# Altium project 16SoundsUSB.PrjPCB (part 2 of 2)

## Sheet ADC.SchDoc
size Tabloid; DocumentNumber: 6; SheetNumber: 6; SheetTotal: 11; SheetName: ADC
Used 2 times, as channels ADC2, ADC1. Parts and nets are listed once, with the designators drawn on the sheet.
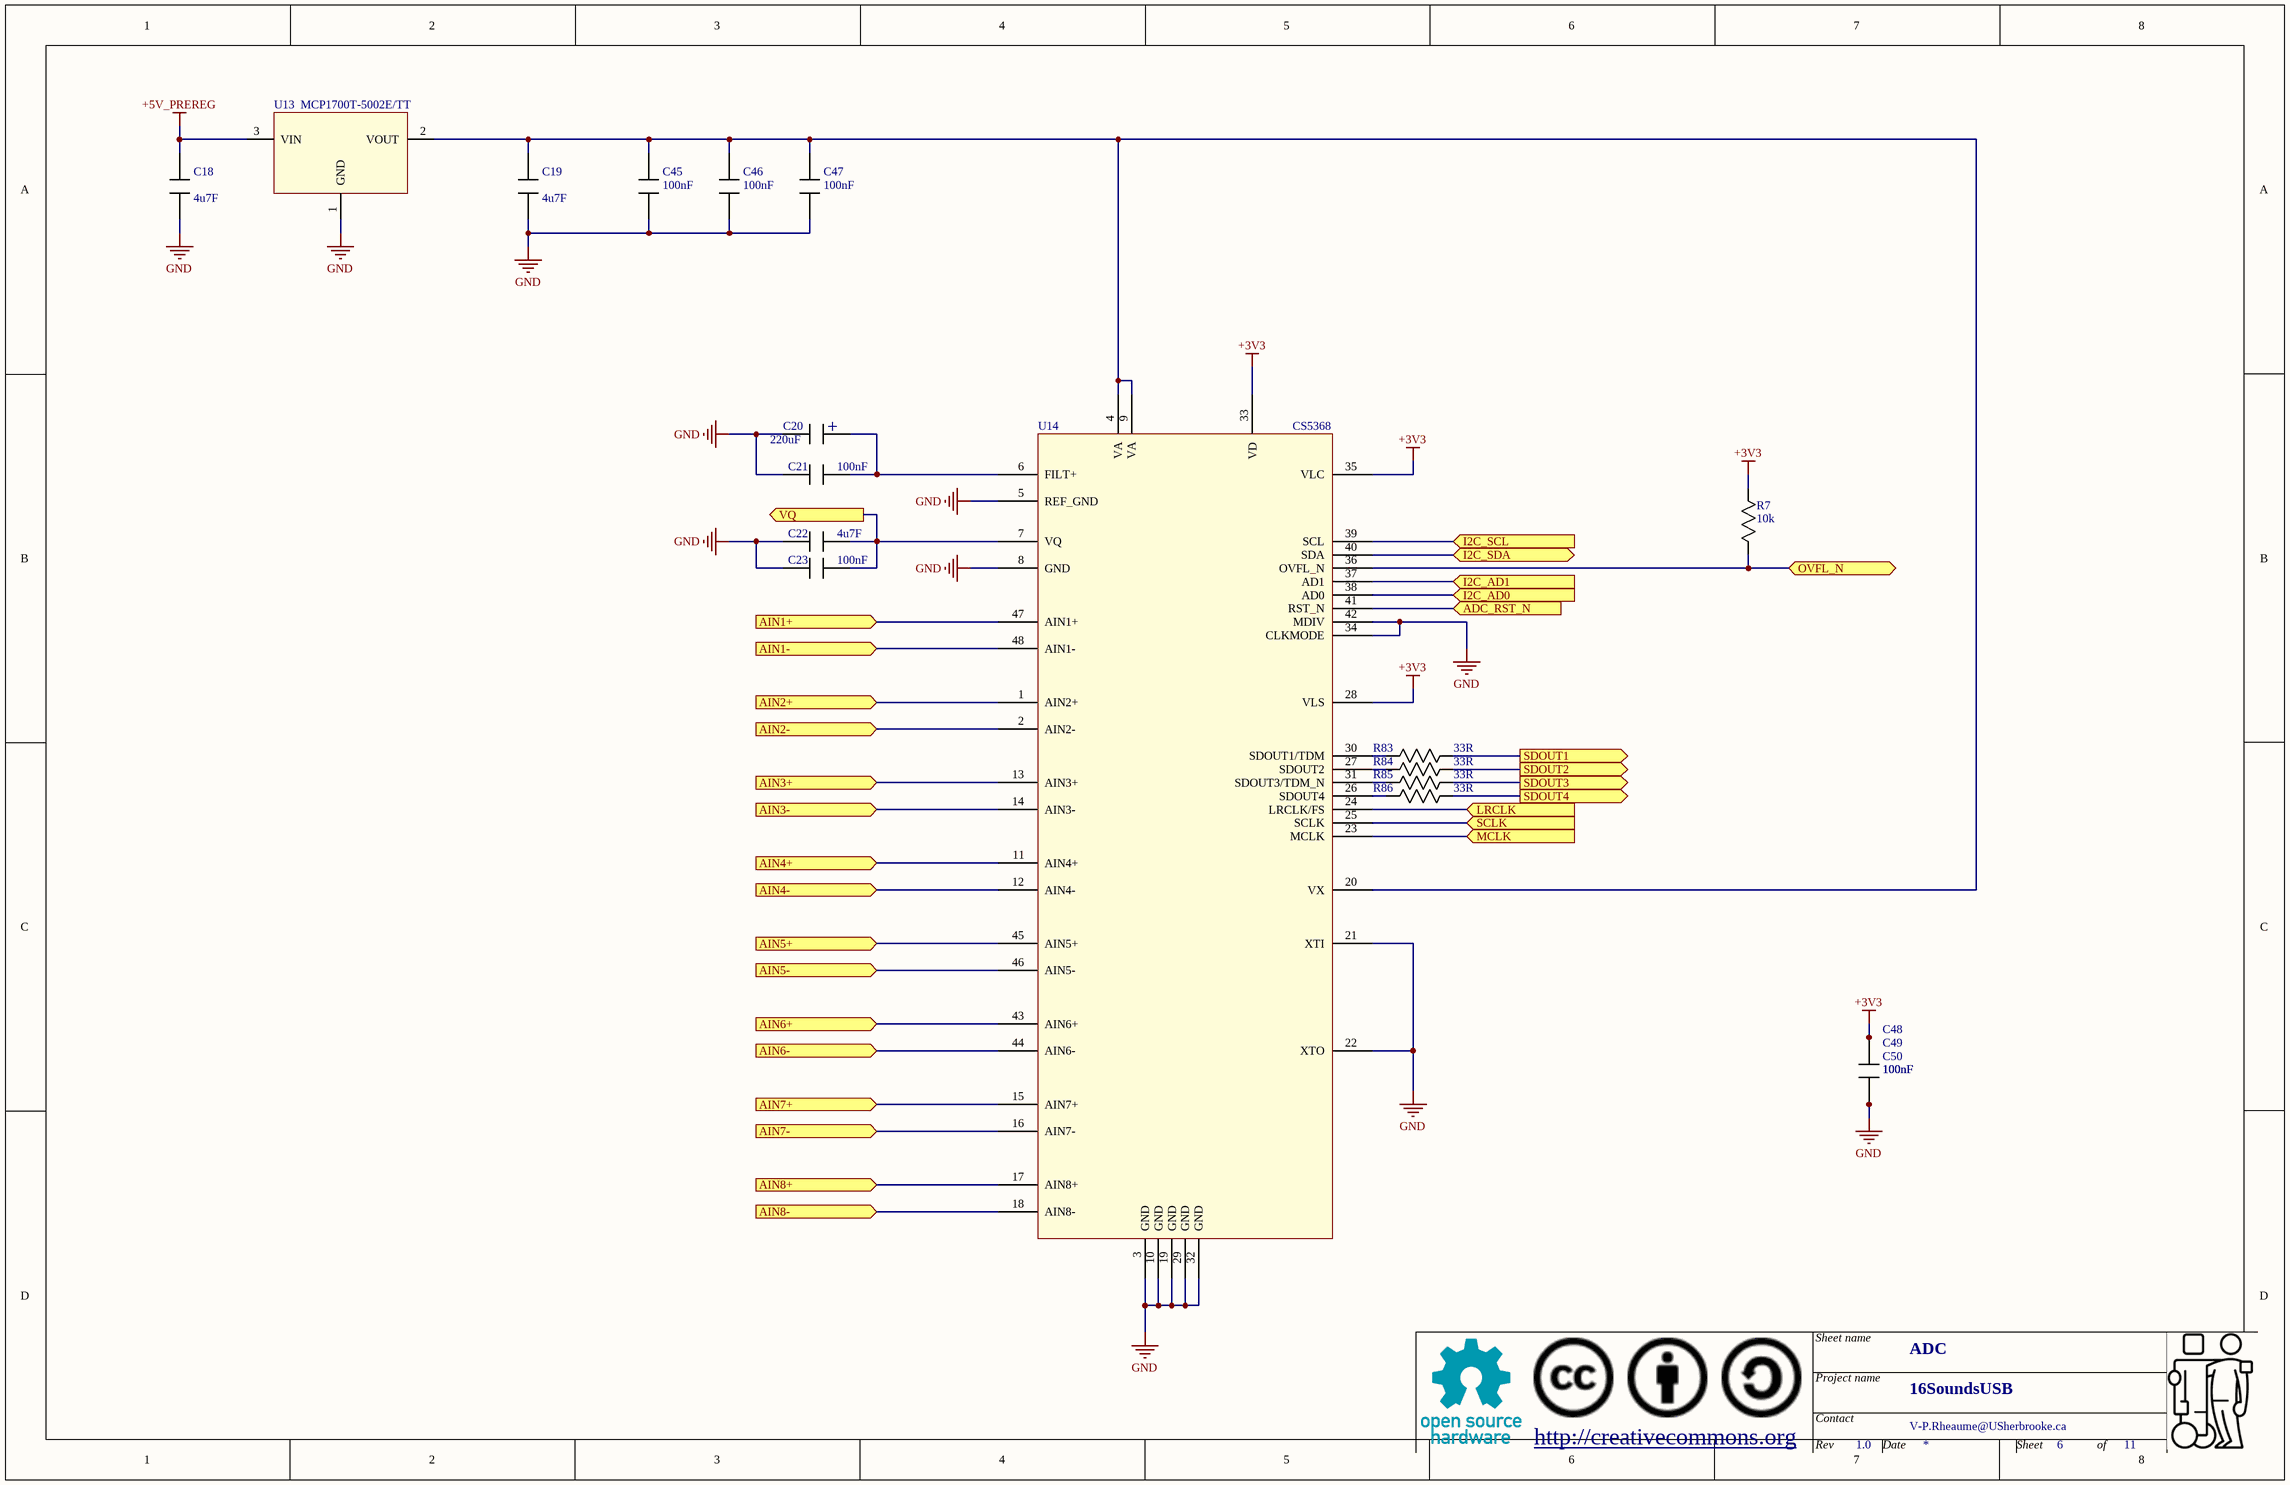
[diagram p7: ADC.SchDoc]

### Parts
C18  value 4u7F  [0805]  (hidden comment: Capacitor)
C19  value 4u7F  [0805]  (hidden comment: Capacitor)
C20  value 220uF  [CAP_RAD_SMD_DIA315]  (hidden comment: Capacitor_Polarized)
C21  value 100nF  [0603]  (hidden comment: Capacitor)
C22  value 4u7F  [0805]  (hidden comment: Capacitor)
C23  value 100nF  [0603]  (hidden comment: Capacitor)
C45  value 100nF  [0603]  (hidden comment: Capacitor)
C46  value 100nF  [0603]  (hidden comment: Capacitor)
C47  value 100nF  [0603]  (hidden comment: Capacitor)
C48  value 100nF  [0603]  (hidden comment: Capacitor)
C49  value 100nF  [0603]  (hidden comment: Capacitor)
C50  value 100nF  [0603]  (hidden comment: Capacitor)
R7  value 10k  [0603]  (hidden comment: Resistor)
R83  value 33R  [0603]  (hidden comment: Resistor)
R84  value 33R  [0603]  (hidden comment: Resistor)
R85  value 33R  [0603]  (hidden comment: Resistor)
R86  value 33R  [0603]  (hidden comment: Resistor)
U13  Mfg_PN: MCP1700T-5002E/TT  [SOT23_132]  (hidden comment: MCP1700)
U14  CS5368  [LQFP_48L_CIRRUS]

### Ports
ADC_RST_N (in), AIN1+ (in), AIN1- (in), AIN2+ (in), AIN2- (in), AIN3+ (in), AIN3- (in), AIN4+ (in), AIN4- (in), AIN5+ (in), AIN5- (in), AIN6+ (in), AIN6- (in), AIN7+ (in), AIN7- (in), AIN8+ (in), AIN8- (in), I2C_AD0 (in), I2C_AD1 (in), I2C_SCL (in), I2C_SDA (bidir), LRCLK (in), MCLK (in), OVFL_N (bidir), SCLK (in), SDOUT1 (out), SDOUT2 (out), SDOUT3 (out), SDOUT4 (out), VQ (out)

### Nets
+3V3: C48.1 C49.1 C50.1 R7.1 U14.28(VLS) U14.33(VD) U14.35(VLC)
+5V_PREREG: C18.1 U13.3(VIN)
GND: C18.2 C19.2 C20.- C21.2 C22.2 C23.2 C45.2 C46.2 C47.2 C48.2 C49.2 C50.2 U13.1(GND) U14.3(GND) U14.5(REF_GND) U14.8(GND) U14.10(GND) U14.19(GND) U14.21(XTI) U14.22(XTO) U14.29(GND) U14.32(GND) U14.34(CLKMODE) U14.42(MDIV)
ADC_RST_N: U14.41(RST_N) ; port ADC_RST_N
AIN1+: U14.47(AIN1+) ; port AIN1+
AIN1-: U14.48(AIN1-) ; port AIN1-
AIN2+: U14.1(AIN2+) ; port AIN2+
AIN2-: U14.2(AIN2-) ; port AIN2-
AIN3+: U14.13(AIN3+) ; port AIN3+
AIN3-: U14.14(AIN3-) ; port AIN3-
AIN4+: U14.11(AIN4+) ; port AIN4+
AIN4-: U14.12(AIN4-) ; port AIN4-
AIN5+: U14.45(AIN5+) ; port AIN5+
AIN5-: U14.46(AIN5-) ; port AIN5-
AIN6+: U14.43(AIN6+) ; port AIN6+
AIN6-: U14.44(AIN6-) ; port AIN6-
AIN7+: U14.15(AIN7+) ; port AIN7+
AIN7-: U14.16(AIN7-) ; port AIN7-
AIN8+: U14.17(AIN8+) ; port AIN8+
AIN8-: U14.18(AIN8-) ; port AIN8-
I2C_AD0: U14.38(AD0) ; port I2C_AD0
I2C_AD1: U14.37(AD1) ; port I2C_AD1
I2C_SCL: U14.39(SCL) ; port I2C_SCL
I2C_SDA: U14.40(SDA) ; port I2C_SDA
LRCLK: U14.24(LRCLK/FS) ; port LRCLK
MCLK: U14.23(MCLK) ; port MCLK
OVFL_N: R7.2 U14.36(OVFL_N) ; port OVFL_N
SCLK: U14.25(SCLK) ; port SCLK
SDOUT1: R83.2 ; port SDOUT1
SDOUT2: R84.2 ; port SDOUT2
SDOUT3: R85.2 ; port SDOUT3
SDOUT4: R86.2 ; port SDOUT4
VQ: C22.1 C23.1 U14.7(VQ) ; port VQ
NetC19_1: C19.1 C45.1 C46.1 C47.1 U13.2(VOUT) U14.4(VA) U14.9(VA) U14.20(VX)
NetC20_+: C20.+ C21.1 U14.6(FILT+)
NetR83_1: R83.1 U14.30(SDOUT1/TDM)
NetR84_1: R84.1 U14.27(SDOUT2)
NetR85_1: R85.1 U14.31(SDOUT3/TDM_N)
NetR86_1: R86.1 U14.26(SDOUT4)

### Channels
ADC2: designators end in _ADC2; ports ADC_RST_N=NetTP3_1 AIN1+=IN13_P AIN1-=IN13_N AIN2+=IN14_P AIN2-=IN14_N AIN3+=IN11_P AIN3-=IN11_N AIN4+=IN12_P AIN4-=IN12_N AIN5+=IN15_P AIN5-=IN15_N AIN6+=IN16_P AIN6-=IN16_N AIN7+=IN9_P AIN7-=IN9_N AIN8+=IN10_P AIN8-=IN10_N I2C_AD0=GND I2C_AD1=GND I2C_SCL=I2C_SCL I2C_SDA=I2C_SDA LRCLK=LRCLK MCLK=MCLK_AUDIO OVFL_N=NetR7_ADC1_2 SCLK=SCLK SDOUT1=ADC2_SDOUT1 SDOUT2=ADC2_SDOUT2 SDOUT3=ADC2_SDOUT3 SDOUT4=ADC2_SDOUT4 VQ=ADC2_VQ
ADC1: designators end in _ADC1; ports ADC_RST_N=NetTP3_1 AIN1+=IN5_P AIN1-=IN5_N AIN2+=IN6_P AIN2-=IN6_N AIN3+=IN3_P AIN3-=IN3_N AIN4+=IN4_P AIN4-=IN4_N AIN5+=IN7_P AIN5-=IN7_N AIN6+=IN8_P AIN6-=IN8_N AIN7+=IN1_P AIN7-=IN1_N AIN8+=IN2_P AIN8-=IN2_N I2C_AD0=+3V3 I2C_AD1=GND I2C_SCL=I2C_SCL I2C_SDA=I2C_SDA LRCLK=LRCLK MCLK=MCLK_AUDIO OVFL_N=NetR7_ADC1_2 SCLK=SCLK SDOUT1=ADC1_SDOUT1 SDOUT2=ADC1_SDOUT2 SDOUT3=ADC1_SDOUT3 SDOUT4=ADC1_SDOUT4 VQ=ADC1_VQ

### Notes on the sheet
- Sheet name
- http://creativecommons.org
- Project name
- Contact
- Rev
- Date
- Sheet
- of

### Library data of the parts
C18 C19 C22 = Capacitor: Mfg: Samsung; Mfg_PN: CL21A475KAQNNNG; HelpURL: *; NI: *; Supplier1: Digikey; Supplier1_PN: 1276-6462-1-ND; Tolerance: *; Type: *; Rating: *
C20 = Capacitor_Polarized: Capacitor; Mfg: Nichicon; Mfg_PN: UWT1E221MNL1GS; HelpURL: *; NI: *; Supplier1: Digikey; Supplier1_PN: 493-2192-1-ND; Tolerance: *; Type: *; Rating: *
C21 C23 C45-C50 = Capacitor: Mfg: Samsung; Mfg_PN: CL10F104ZO8NNNC; HelpURL: *; NI: *; Supplier1: Digikey; Supplier1_PN: 1276-1258-1-ND; Tolerance: *; Type: *; Rating: *
R7 = Resistor: Mfg: Yageo; Mfg_PN: RC0603JR-0710KL; HelpURL: *; NI: *; Supplier1: Digikey; Supplier1_PN: 311-10KGRCT-ND; Type: *; Rating: *; Tolerance: *
R83-R86 = Resistor: Mfg: Yageo; Mfg_PN: RC0603JR-0733RL; HelpURL: *; NI: *; Supplier1: Digikey; Supplier1_PN: 311-33GRCT-ND; Type: *; Rating: *; Tolerance: *
U13 = MCP1700: Linear voltage regulator; Mfg: Microchip; HelpURL: http://ww1.microchip.com/downloads/en/DeviceDoc/20001826C.pdf; NI: *; Supplier1: Digikey; Supplier1_PN: MCP1700T5002ETTCT-ND; Type: *
U14 = CS5368: ADC, 24bit, 8 chan, 192kHz, PCM, TDM, LQFP48; Mfg_PN: CS5368-CQZ; Mfg: Cirrus; Supplier1: Digikey; Supplier1_PN: 598-1090-ND

## Sheet DAC.SchDoc
size Tabloid; DocumentNumber: 7; SheetNumber: 7; SheetTotal: 11; SheetName: DAC
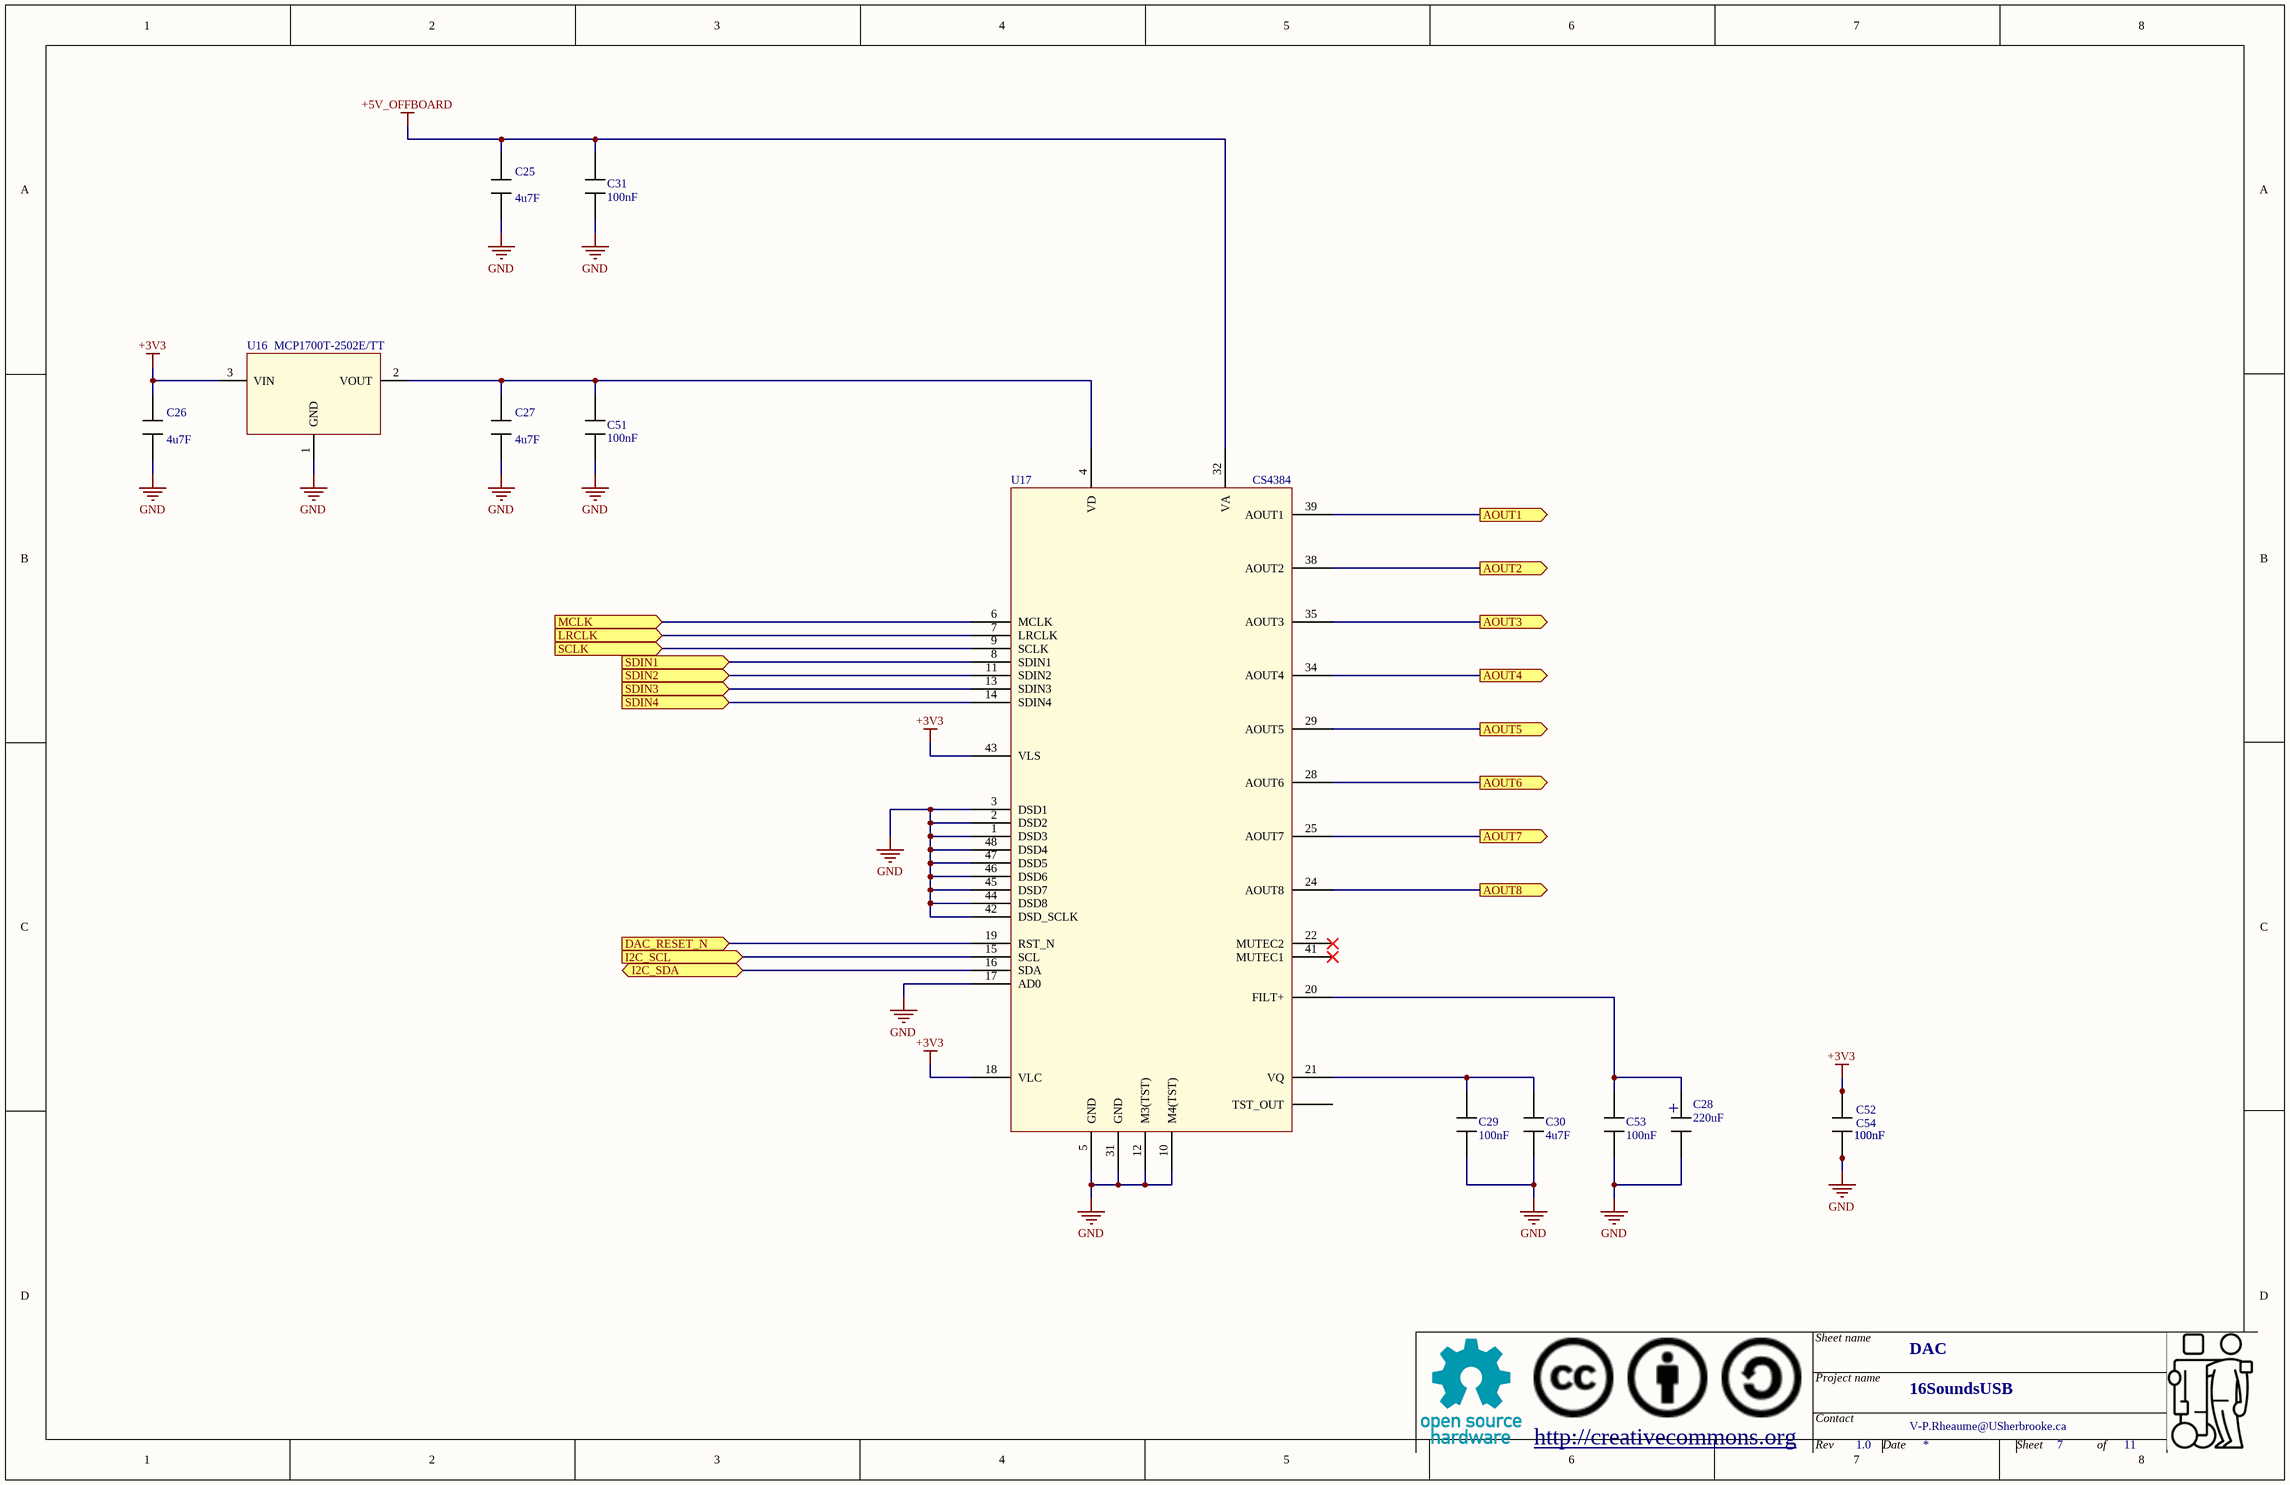
[diagram p8: DAC.SchDoc]

### Parts
C25  value 4u7F  [0805]  (hidden comment: Capacitor)
C26  value 4u7F  [0805]  (hidden comment: Capacitor)
C27  value 4u7F  [0805]  (hidden comment: Capacitor)
C28  value 220uF  [CAP_RAD_SMD_DIA315]  (hidden comment: Capacitor_Polarized)
C29  value 100nF  [0603]  (hidden comment: Capacitor)
C30  value 4u7F  [0805]  (hidden comment: Capacitor)
C31  value 100nF  [0603]  (hidden comment: Capacitor)
C51  value 100nF  [0603]  (hidden comment: Capacitor)
C52  value 100nF  [0603]  (hidden comment: Capacitor)
C53  value 100nF  [0603]  (hidden comment: Capacitor)
C54  value 100nF  [0603]  (hidden comment: Capacitor)
U16  Mfg_PN: MCP1700T-2502E/TT  [SOT23_132]  (hidden comment: MCP1700)
U17  CS4384  [LQFP_48L_CIRRUS]

### Ports
AOUT1 (out), AOUT2 (out), AOUT3 (out), AOUT4 (out), AOUT5 (out), AOUT6 (out), AOUT7 (out), AOUT8 (out), DAC_RESET_N (in), I2C_SCL (in), I2C_SDA (bidir), LRCLK (in), MCLK (in), SCLK (in), SDIN1 (in), SDIN2 (in), SDIN3 (in), SDIN4 (in)

### Nets
+3V3: C26.1 C52.1 C54.1 U16.3(VIN) U17.18(VLC) U17.43(VLS)
+5V_OFFBOARD: C25.1 C31.1 U17.32(VA)
GND: C25.2 C26.2 C27.2 C28.- C29.2 C30.2 C31.2 C51.2 C52.2 C53.2 C54.2 U16.1(GND) U17.1(DSD3) U17.2(DSD2) U17.3(DSD1) U17.5(GND) U17.10(M4(TST)) U17.12(M3(TST)) U17.17(AD0) U17.31(GND) U17.42(DSD_SCLK) U17.44(DSD8) U17.45(DSD7) U17.46(DSD6) U17.47(DSD5) U17.48(DSD4)
DAC_SDIN1: U17.8(SDIN1) ; port SDIN1
DAC_SDIN2: U17.11(SDIN2) ; port SDIN2
I2C_SCL: U17.15(SCL) ; port I2C_SCL
I2C_SDA: U17.16(SDA) ; port I2C_SDA
LRCLK: U17.7(LRCLK) ; port LRCLK
MCLK_AUDIO: U17.6(MCLK) ; port MCLK
SCLK: U17.9(SCLK) ; port SCLK
NetC27_1: C27.1 C51.1 U16.2(VOUT) U17.4(VD)
NetC28_+: C28.+ C53.1 U17.20(FILT+)
NetC29_1: C29.1 C30.1 U17.21(VQ)
NetC36_+: U17.39(AOUT1) ; port AOUT1
NetC37_+: U17.35(AOUT3) ; port AOUT3
NetC40_+: U17.38(AOUT2) ; port AOUT2
NetC41_+: U17.34(AOUT4) ; port AOUT4
NetU4_94: U17.19(RST_N) ; port DAC_RESET_N
NetU17_13: U17.13(SDIN3) ; port SDIN3
NetU17_14: U17.14(SDIN4) ; port SDIN4
NetU17_24: U17.24(AOUT8) ; port AOUT8
NetU17_25: U17.25(AOUT7) ; port AOUT7
NetU17_28: U17.28(AOUT6) ; port AOUT6
NetU17_29: U17.29(AOUT5) ; port AOUT5

Not connected (* = marked no-connect by the designer): U17 22(MUTEC2)* 23(TST_OUT) 26(TST_OUT) 27(TST_OUT) 30(TST_OUT) 33(TST_OUT) 36(TST_OUT) 37(TST_OUT) 40(TST_OUT) 41(MUTEC1)*

### Notes on the sheet
- Sheet name
- http://creativecommons.org
- Project name
- Contact
- Rev
- Date
- Sheet
- of

### Library data of the parts
C25-C27 C30 = Capacitor: Mfg: Samsung; Mfg_PN: CL21A475KAQNNNG; HelpURL: *; NI: *; Supplier1: Digikey; Supplier1_PN: 1276-6462-1-ND; Tolerance: *; Type: *; Rating: *
C28 = Capacitor_Polarized: as C20 on sheet ADC; HelpURL: *; NI: *; Supplier1: Digikey; Supplier1_PN: 493-2192-1-ND; Tolerance: *; Type: *; Rating: *
C29 C31 C51-C54 = Capacitor: Mfg: Samsung; Mfg_PN: CL10F104ZO8NNNC; HelpURL: *; NI: *; Supplier1: Digikey; Supplier1_PN: 1276-1258-1-ND; Tolerance: *; Type: *; Rating: *
U16 = MCP1700: Linear voltage regulator; Mfg: Microchip; HelpURL: http://ww1.microchip.com/downloads/en/DeviceDoc/20001826C.pdf; NI: *; Supplier1: Digikey; Supplier1_PN: MCP1700T-2502E/TTCT-ND; Type: *
U17 = CS4384: DAC, 24-bit, 8 chan, 192kHz, PCM, TDM, DSD, LQFP48; Mfg: Cirrus; Mfg_PN: CS4384-CQZ; Supplier1: Digikey; Supplier1_PN: 598-1062-ND

## Sheet OutputConnectors.SchDoc
size Tabloid; DocumentNumber: 8; SheetNumber: 8; SheetTotal: 11; SheetName: Audio output connectors
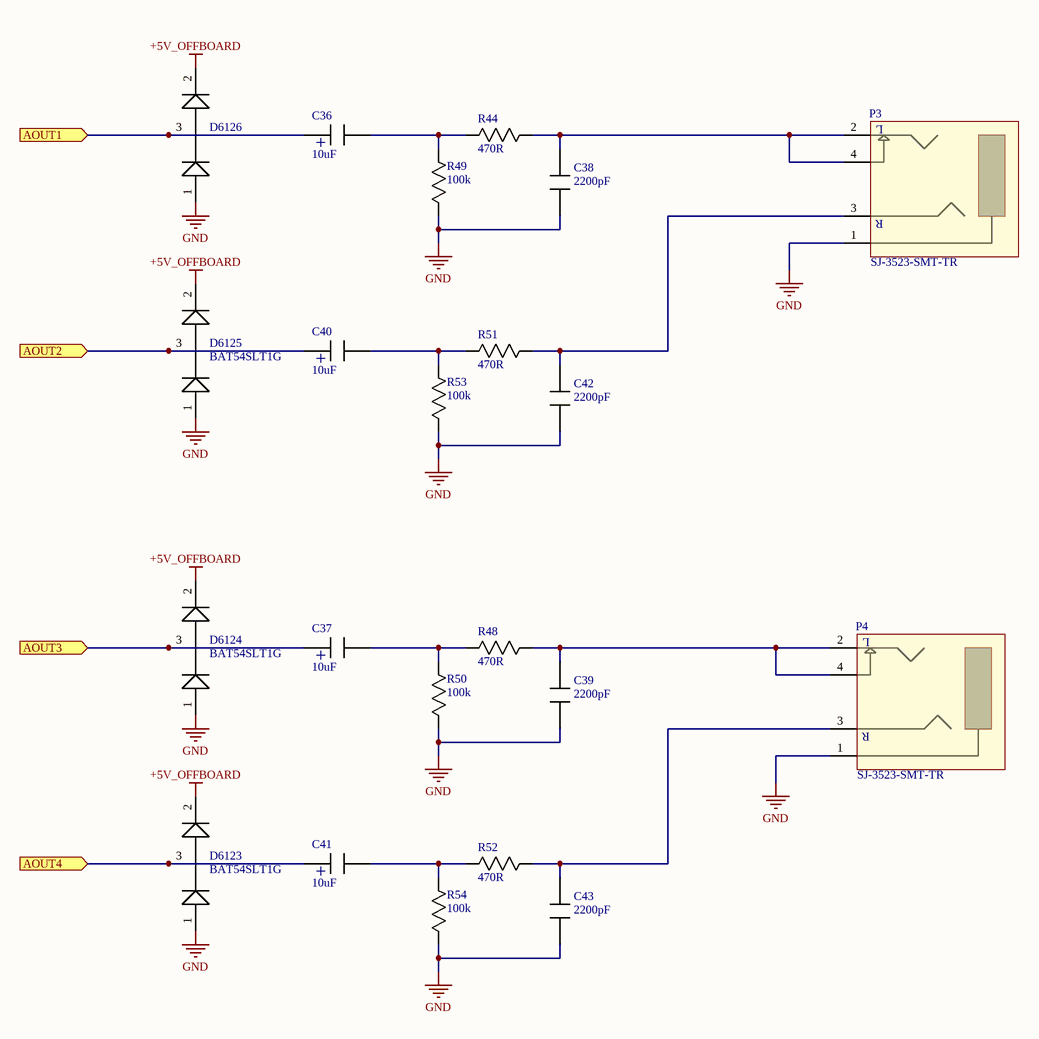
[diagram p9: OutputConnectors.SchDoc]

### Parts
C36  value 10uF  [CAP_RAD_SMD_DIA157]  (hidden comment: Capacitor_Polarized)
C37  value 10uF  [CAP_RAD_SMD_DIA157]  (hidden comment: Capacitor_Polarized)
C38  value 2200pF  [0603]  (hidden comment: Capacitor)
C39  value 2200pF  [0603]  (hidden comment: Capacitor)
C40  value 10uF  [CAP_RAD_SMD_DIA157]  (hidden comment: Capacitor_Polarized)
C41  value 10uF  [CAP_RAD_SMD_DIA157]  (hidden comment: Capacitor_Polarized)
C42  value 2200pF  [0603]  (hidden comment: Capacitor)
C43  value 2200pF  [0603]  (hidden comment: Capacitor)
D6123  Mfg_PN: BAT54SLT1G  [SOT23_132]  (hidden comment: Diode_dual)
D6124  Mfg_PN: BAT54SLT1G  [SOT23_132]  (hidden comment: Diode_dual)
D6125  Mfg_PN: BAT54SLT1G  [SOT23_132]  (hidden comment: Diode_dual)
D6126  Diode_dual  [SOT23_132]  (value not drawn)
P3  Mfg_PN: SJ-3523-SMT-TR  [CONN_3.5mm_CUI 3523-SMT]  (hidden comment: CON_AUDIO_3.5mm_TRS_ALT1)
P4  Mfg_PN: SJ-3523-SMT-TR  [CONN_3.5mm_CUI 3523-SMT]  (hidden comment: CON_AUDIO_3.5mm_TRS_ALT1)
R44  value 470R  [0603]  (hidden comment: Resistor)
R48  value 470R  [0603]  (hidden comment: Resistor)
R49  value 100k  [0603]  (hidden comment: Resistor)
R50  value 100k  [0603]  (hidden comment: Resistor)
R51  value 470R  [0603]  (hidden comment: Resistor)
R52  value 470R  [0603]  (hidden comment: Resistor)
R53  value 100k  [0603]  (hidden comment: Resistor)
R54  value 100k  [0603]  (hidden comment: Resistor)

### Ports
AOUT1 (in), AOUT2 (in), AOUT3 (in), AOUT4 (in)

### Nets
+5V_OFFBOARD: D6123.2(K) D6124.2(K) D6125.2(K) D6126.2(K)
GND: C38.2 C39.2 C42.2 C43.2 D6123.1(K) D6124.1(K) D6125.1(K) D6126.1(K) P3.1 P4.1 R49.1 R50.1 R53.1 R54.1
NetC36_+: C36.+ D6126.3(AK) ; port AOUT1
NetC36_-: C36.- R44.1 R49.2
NetC37_+: C37.+ D6124.3(AK) ; port AOUT3
NetC37_-: C37.- R48.1 R50.2
NetC38_1: C38.1 P3.2(L) P3.4(NC_L) R44.2
NetC39_1: C39.1 P4.2(L) P4.4(NC_L) R48.2
NetC40_+: C40.+ D6125.3(AK) ; port AOUT2
NetC40_-: C40.- R51.1 R53.2
NetC41_+: C41.+ D6123.3(AK) ; port AOUT4
NetC41_-: C41.- R52.1 R54.2
NetC42_1: C42.1 P3.3(R) R51.2
NetC43_1: C43.1 P4.3(R) R52.2

### Notes on the sheet
- Sheet name
- http://creativecommons.org
- Project name
- Contact
- Rev
- Date
- Sheet
- of

### Library data of the parts
C36 C37 C40 C41 = Capacitor_Polarized: Capacitor; Mfg: Nichicon; Mfg_PN: UWX1C100MCL1GB; HelpURL: *; NI: *; Supplier1: Digikey; Supplier1_PN: 493-2100-1-ND; Tolerance: *; Type: *; Rating: *
C38 C39 C42 C43 = Capacitor: Mfg: Murata; Mfg_PN: GRM1885C1H222JA01D; HelpURL: *; NI: *; Supplier1: Digikey; Supplier1_PN: 490-1459-1-ND; Tolerance: *; Type: *; Rating: *
D6123-D6125 = Diode_dual: Diode; Mfg: Onsemi; HelpURL: *; NI: *; Supplier1: Digikey; Supplier1_PN: BAT54SLT1GOSCT-ND; Tolerance: *; Type: *; Rating: *; Value: *
D6126 = Diode_dual: Diode; Mfg: Onsemi; Mfg_PN: BAT54SLT1G; HelpURL: *; NI: *; Supplier1: Digikey; Supplier1_PN: BAT54SLT1GOSCT-ND; Tolerance: *; Type: *; Rating: *; Value: *
P3 P4 = CON_AUDIO_3.5mm_TRS_ALT1: Audio 3.5mm CUI SJ-3523-SMT-TR; HelpURL: *; Mfg: CUI; NI: *; Rating: *; Supplier1: Digikey; Supplier1_PN: CP-3523SJCT-ND; Tolerance: *; Type: *; Value: *
R44 R48 R51 R52 = Resistor: Mfg: Yageo; Mfg_PN: RC0603JR-07470RL; HelpURL: *; NI: *; Supplier1: Digikey; Supplier1_PN: 311-470GRCT-ND; Type: *; Rating: *; Tolerance: *
R49 R50 R53 R54 = Resistor: Mfg: Yageo; Mfg_PN: 311-10GRCT-ND; HelpURL: *; NI: *; Supplier1: Digikey; Supplier1_PN: 311-100KGRCT-ND; Type: *; Rating: *; Tolerance: *

## Sheet Other.SchDoc
size Tabloid; DocumentNumber: 9; SheetNumber: 9; SheetTotal: 11; SheetName: LEDs and I2C exp. connector
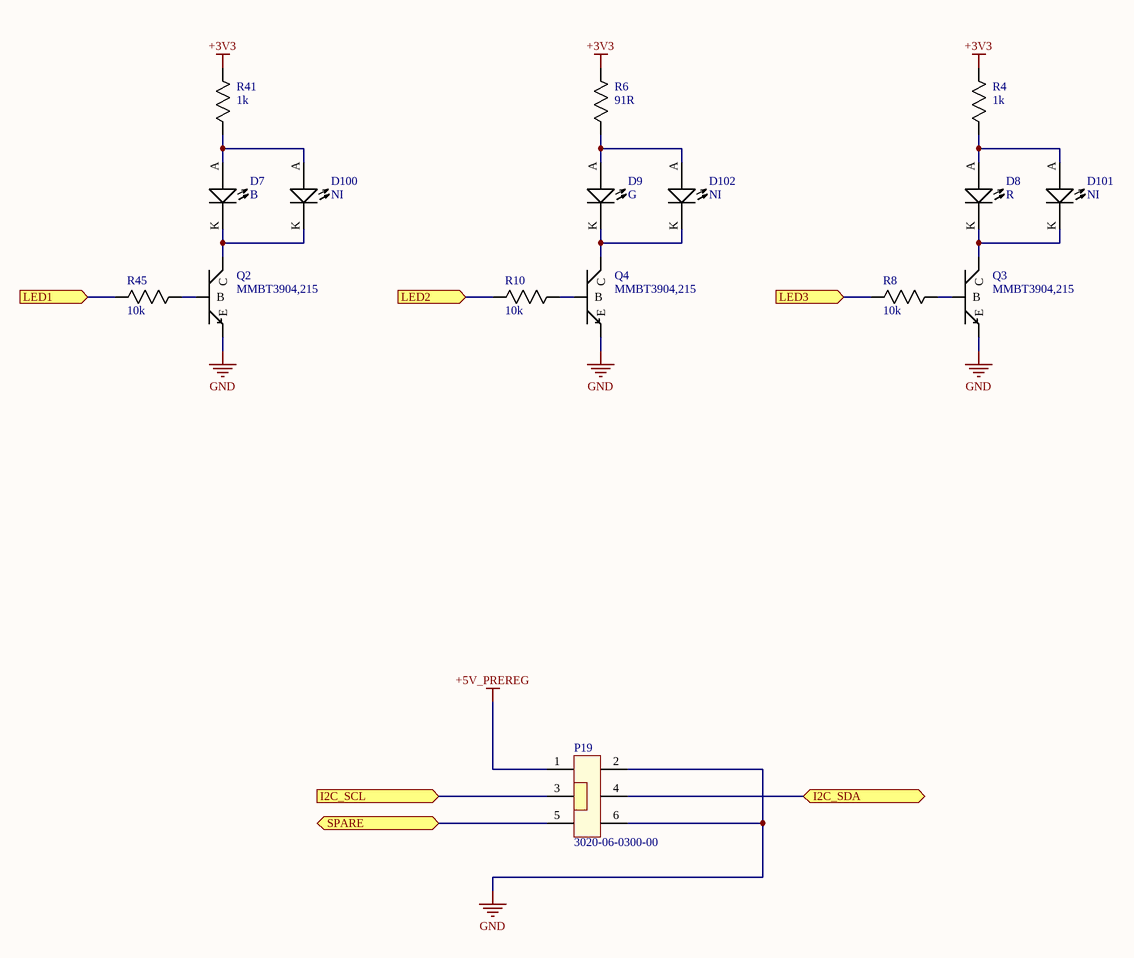
[diagram p10: Other.SchDoc]

### Parts
(Parts that share a designator on the sheet are numbered #1, #2 ... from top to bottom, then left to right.)
D7  Type: B  [0805_LED]  (hidden comment: Diode_LED)
D8  Type: R  [0805_LED]  (hidden comment: Diode_LED)
D9  Type: G  [0805_LED]  (hidden comment: Diode_LED)
D100  Diode_LED  [0805_LED]  (value not drawn)
D101  Diode_LED  [0805_LED]  (value not drawn)
D102  Diode_LED  [0805_LED]  (value not drawn)
P19  Mfg_PN: 3020-06-0300-00  [CONN6_100mils_pol_SMD]  (hidden comment: CON6_3020-06-0300-00)
Q2  Mfg_PN: MMBT3904,215  [SOT23_GDS]  (hidden comment: BJT_N_GDS)
Q3  Mfg_PN: MMBT3904,215  [SOT23_GDS]  (hidden comment: BJT_N_GDS)
Q4#2  Mfg_PN: MMBT3904,215  [SOT23_GDS]  (hidden comment: BJT_N_GDS)
R4  value 1k  [0603]  (hidden comment: Resistor)
R6  value 91R  [0603]  (hidden comment: Resistor)
R8  value 10k  [0603]  (hidden comment: Resistor)
R10  value 10k  [0603]  (hidden comment: Resistor)
R41  value 1k  [0603]  (hidden comment: Resistor)
R45  value 10k  [0603]  (hidden comment: Resistor)

### Ports
I2C_SCL (in), I2C_SDA (bidir), LED1 (in), LED2 (in), LED3 (in), SPARE (bidir)

### Nets
+3V3: R4.2 R6.2 R41.2
+5V_PREREG: P19.1
GND: P19.2 P19.6 Q2.S(E) Q3.S(E) Q4#2.S(E)
I2C_SCL: P19.3 ; port I2C_SCL
I2C_SDA: P19.4 ; port I2C_SDA
NetD7_A: D7.A D100.A R41.1
NetD7_K: D7.K D100.K Q2.D(C)
NetD8_A: D8.A D101.A R4.1
NetD8_K: D8.K D101.K Q3.D(C)
NetD9_A: D9.A D102.A R6.1
NetD9_K: D9.K D102.K Q4#2.D(C)
NetP19_5: P19.5 ; port SPARE
NetQ2_G: Q2.G(B) R45.2
NetQ3_G: Q3.G(B) R8.2
NetQ4#2_G: Q4#2.G(B) R10.2
NetR8_1: R8.1 ; port LED3
NetR10_1: R10.1 ; port LED2
NetR45_1: R45.1 ; port LED1

### Notes on the sheet
- Sheet name
- http://creativecommons.org
- Project name
- Contact
- Rev
- Date
- Sheet
- of

### Library data of the parts
D7 = Diode_LED: LED; Mfg: Wurth; Mfg_PN: 150080BS75000; HelpURL: *; NI: *; Supplier1: Digikey; Supplier1_PN: 732-4982-1-ND; Tolerance: *; Rating: *; Value: *
D8 = Diode_LED: LED; Mfg: Osram; Mfg_PN: LS R976-NR-1; HelpURL: *; NI: *; Supplier1: Digikey; Supplier1_PN: 475-1278-1-ND; Tolerance: *; Rating: *; Value: *
D9 = Diode_LED: LED; Mfg: Osram; Mfg_PN: LG R971-KN-1; HelpURL: *; NI: *; Supplier1: Digikey; Supplier1_PN: 475-1410-1-ND; Tolerance: *; Rating: *; Value: *
D100-D102 = Diode_LED: LED; Type: R; HelpURL: *; Mfg: *; Mfg_PN: *; NI: NI; Supplier1: *; Supplier1_PN: *; Tolerance: *; Rating: *; Value: *
P19 = CON6_3020-06-0300-00: 6-pins; Mfg: Harwin; HelpURL: *; NI: *; Rating: *; Supplier1: Digikey; Supplier1_PN: 3020-06-0300-00-ND; Tolerance: *; Type: *; Value: *
Q2 Q3 Q4#2 = BJT_N_GDS: BJT NPN; Mfg: NXP; HelpURL: *; NI: *; Rating: *; Supplier1: Digikey; Supplier1_PN: 568-4510-1-ND; Tolerance: *; Type: *; Value: *
R4 R41 = Resistor: Mfg: Yageo; Mfg_PN: RC0603JR-071KL; HelpURL: *; NI: *; Supplier1: Digikey; Supplier1_PN: 311-1.0KGRCT-ND; Type: *; Rating: *; Tolerance: *
R6 = Resistor: Mfg: Yageo; Mfg_PN: RC0603JR-0791RL; HelpURL: *; NI: *; Supplier1: Digikey; Supplier1_PN: 311-91GRCT-ND; Type: *; Rating: *; Tolerance: *
R8 R10 R45 = Resistor: Mfg: Yageo; Mfg_PN: RC0603JR-0710KL; HelpURL: *; NI: *; Supplier1: Digikey; Supplier1_PN: 311-10KGRCT-ND; Type: *; Rating: *; Tolerance: *

## Nets that join several sheets
+1V0: TopLevel (TP12.1 TP12.2), XMOS_power (33 pins)
+3V3: TopLevel (TP9.1 TP9.2), XMOS_chip (R5.1 R38.1 R39.1 R68.1), XMOS_power (31 pins), Clock (5 pins), ADC2 (7 pins), ADC1 (8 pins), DAC (6 pins), Other (R4.2 R6.2 R41.2)
+5V_OFFBOARD: TopLevel (TP11.1 TP11.2), Power (5 pins), AudioInputs_9-15/InputAmplifier1 (5 pins), AudioInputs_9-15/InputAmplifier2 (5 pins), AudioInputs_9-15/InputAmplifier3 (5 pins), AudioInputs_9-15/InputAmplifier4 (5 pins), AudioInputs_9-15/InputAmplifier5 (5 pins), AudioInputs_9-15/InputAmplifier6 (5 pins), AudioInputs_9-15/InputAmplifier7 (5 pins), AudioInputs_9-15/InputAmplifier8 (5 pins), AudioInputs_1-8/InputAmplifier1 (5 pins), AudioInputs_1-8/InputAmplifier2 (5 pins), AudioInputs_1-8/InputAmplifier3 (5 pins), AudioInputs_1-8/InputAmplifier4 (5 pins), AudioInputs_1-8/InputAmplifier5 (5 pins), AudioInputs_1-8/InputAmplifier6 (5 pins), AudioInputs_1-8/InputAmplifier7 (5 pins), AudioInputs_1-8/InputAmplifier8 (5 pins), DAC (C25.1 C31.1 U17.32), OutputConnectors (D6123.2 D6124.2 D6125.2 D6126.2)
+5V_PREREG: TopLevel (TP10.1 TP10.2), Power (5 pins), ADC2 (C18_ADC2.1 U13_ADC2.3), ADC1 (C18_ADC1.1 U13_ADC1.3), Other (P19.1)
GND: TopLevel (10 pins), Power (21 pins), XMOS_chip (13 pins), XMOS_power (47 pins), AudioInputs_9-15/InputAmplifier1 (9 pins), AudioInputs_9-15/InputAmplifier2 (9 pins), AudioInputs_9-15/InputAmplifier3 (9 pins), AudioInputs_9-15/InputAmplifier4 (9 pins), AudioInputs_9-15/InputAmplifier5 (9 pins), AudioInputs_9-15/InputAmplifier6 (9 pins), AudioInputs_9-15/InputAmplifier7 (9 pins), AudioInputs_9-15/InputAmplifier8 (9 pins), Clock (5 pins), AudioInputs_1-8/InputAmplifier1 (9 pins), AudioInputs_1-8/InputAmplifier2 (9 pins), AudioInputs_1-8/InputAmplifier3 (9 pins), AudioInputs_1-8/InputAmplifier4 (9 pins), AudioInputs_1-8/InputAmplifier5 (9 pins), AudioInputs_1-8/InputAmplifier6 (9 pins), AudioInputs_1-8/InputAmplifier7 (9 pins), AudioInputs_1-8/InputAmplifier8 (9 pins), ADC2 (26 pins), ADC1 (25 pins), DAC (26 pins), OutputConnectors (14 pins), Other (5 pins)
VIN: Power (9 pins), XMOS_power (7 pins)
VUSB: Power (D132.2 Q4#1.D R1234.2), XMOS_chip (C14.1 L4.1 U4.45 U12.5)
ADC1_SDOUT1: XMOS_chip (U4.88), ADC1 (R83_ADC1.2)
ADC1_SDOUT2: XMOS_chip (U4.89), ADC1 (R84_ADC1.2)
ADC1_SDOUT3: XMOS_chip (U4.62), ADC1 (R85_ADC1.2)
ADC1_SDOUT4: XMOS_chip (U4.90), ADC1 (R86_ADC1.2)
ADC1_VQ: AudioInputs_1-8/InputAmplifier1 (C55_AudioInputs_1-8_InputAmplifier1.1 R25_AudioInputs_1-8_InputAmplifier1.1 R31_AudioInputs_1-8_InputAmplifier1.2), AudioInputs_1-8/InputAmplifier2 (C55_AudioInputs_1-8_InputAmplifier2.1 R25_AudioInputs_1-8_InputAmplifier2.1 R31_AudioInputs_1-8_InputAmplifier2.2), AudioInputs_1-8/InputAmplifier3 (C55_AudioInputs_1-8_InputAmplifier3.1 R25_AudioInputs_1-8_InputAmplifier3.1 R31_AudioInputs_1-8_InputAmplifier3.2), AudioInputs_1-8/InputAmplifier4 (C55_AudioInputs_1-8_InputAmplifier4.1 R25_AudioInputs_1-8_InputAmplifier4.1 R31_AudioInputs_1-8_InputAmplifier4.2), AudioInputs_1-8/InputAmplifier5 (C55_AudioInputs_1-8_InputAmplifier5.1 R25_AudioInputs_1-8_InputAmplifier5.1 R31_AudioInputs_1-8_InputAmplifier5.2), AudioInputs_1-8/InputAmplifier6 (C55_AudioInputs_1-8_InputAmplifier6.1 R25_AudioInputs_1-8_InputAmplifier6.1 R31_AudioInputs_1-8_InputAmplifier6.2), AudioInputs_1-8/InputAmplifier7 (C55_AudioInputs_1-8_InputAmplifier7.1 R25_AudioInputs_1-8_InputAmplifier7.1 R31_AudioInputs_1-8_InputAmplifier7.2), AudioInputs_1-8/InputAmplifier8 (C55_AudioInputs_1-8_InputAmplifier8.1 R25_AudioInputs_1-8_InputAmplifier8.1 R31_AudioInputs_1-8_InputAmplifier8.2), ADC1 (C22_ADC1.1 C23_ADC1.1 U14_ADC1.7)
ADC2_SDOUT1: XMOS_chip (U4.4), ADC2 (R83_ADC2.2)
ADC2_SDOUT2: XMOS_chip (U4.5), ADC2 (R84_ADC2.2)
ADC2_SDOUT3: XMOS_chip (U4.3), ADC2 (R85_ADC2.2)
ADC2_SDOUT4: XMOS_chip (U4.7), ADC2 (R86_ADC2.2)
ADC2_VQ: AudioInputs_9-15/InputAmplifier1 (C55_AudioInputs_9-15_InputAmplifier1.1 R25_AudioInputs_9-15_InputAmplifier1.1 R31_AudioInputs_9-15_InputAmplifier1.2), AudioInputs_9-15/InputAmplifier2 (C55_AudioInputs_9-15_InputAmplifier2.1 R25_AudioInputs_9-15_InputAmplifier2.1 R31_AudioInputs_9-15_InputAmplifier2.2), AudioInputs_9-15/InputAmplifier3 (C55_AudioInputs_9-15_InputAmplifier3.1 R25_AudioInputs_9-15_InputAmplifier3.1 R31_AudioInputs_9-15_InputAmplifier3.2), AudioInputs_9-15/InputAmplifier4 (C55_AudioInputs_9-15_InputAmplifier4.1 R25_AudioInputs_9-15_InputAmplifier4.1 R31_AudioInputs_9-15_InputAmplifier4.2), AudioInputs_9-15/InputAmplifier5 (C55_AudioInputs_9-15_InputAmplifier5.1 R25_AudioInputs_9-15_InputAmplifier5.1 R31_AudioInputs_9-15_InputAmplifier5.2), AudioInputs_9-15/InputAmplifier6 (C55_AudioInputs_9-15_InputAmplifier6.1 R25_AudioInputs_9-15_InputAmplifier6.1 R31_AudioInputs_9-15_InputAmplifier6.2), AudioInputs_9-15/InputAmplifier7 (C55_AudioInputs_9-15_InputAmplifier7.1 R25_AudioInputs_9-15_InputAmplifier7.1 R31_AudioInputs_9-15_InputAmplifier7.2), AudioInputs_9-15/InputAmplifier8 (C55_AudioInputs_9-15_InputAmplifier8.1 R25_AudioInputs_9-15_InputAmplifier8.1 R31_AudioInputs_9-15_InputAmplifier8.2), ADC2 (C22_ADC2.1 C23_ADC2.1 U14_ADC2.7)
DAC_SDIN1: XMOS_chip (U4.32), DAC (U17.8)
DAC_SDIN2: XMOS_chip (U4.91), DAC (U17.11)
I2C_SCL: TopLevel (TP1.1 TP1.2), XMOS_chip (R38.2 U4.37), Clock (U2.9), ADC2 (U14_ADC2.39), ADC1 (U14_ADC1.39), DAC (U17.15), Other (P19.3)
I2C_SDA: TopLevel (TP2.1 TP2.2), XMOS_chip (R5.2 U4.38), Clock (U2.10), ADC2 (U14_ADC2.40), ADC1 (U14_ADC1.40), DAC (U17.16), Other (P19.4)
IN1_N: AudioInputs_1-8/InputAmplifier1 (C33_AudioInputs_1-8_InputAmplifier1.2 R34_AudioInputs_1-8_InputAmplifier1.2 R43_AudioInputs_1-8_InputAmplifier1.2), ADC1 (U14_ADC1.16)
IN1_P: AudioInputs_1-8/InputAmplifier1 (C33_AudioInputs_1-8_InputAmplifier1.1 R26_AudioInputs_1-8_InputAmplifier1.2 R69_AudioInputs_1-8_InputAmplifier1.2), ADC1 (U14_ADC1.15)
IN2_N: AudioInputs_1-8/InputAmplifier2 (C33_AudioInputs_1-8_InputAmplifier2.2 R34_AudioInputs_1-8_InputAmplifier2.2 R43_AudioInputs_1-8_InputAmplifier2.2), ADC1 (U14_ADC1.18)
IN2_P: AudioInputs_1-8/InputAmplifier2 (C33_AudioInputs_1-8_InputAmplifier2.1 R26_AudioInputs_1-8_InputAmplifier2.2 R69_AudioInputs_1-8_InputAmplifier2.2), ADC1 (U14_ADC1.17)
IN3_N: AudioInputs_1-8/InputAmplifier3 (C33_AudioInputs_1-8_InputAmplifier3.2 R34_AudioInputs_1-8_InputAmplifier3.2 R43_AudioInputs_1-8_InputAmplifier3.2), ADC1 (U14_ADC1.14)
IN3_P: AudioInputs_1-8/InputAmplifier3 (C33_AudioInputs_1-8_InputAmplifier3.1 R26_AudioInputs_1-8_InputAmplifier3.2 R69_AudioInputs_1-8_InputAmplifier3.2), ADC1 (U14_ADC1.13)
IN4_N: AudioInputs_1-8/InputAmplifier4 (C33_AudioInputs_1-8_InputAmplifier4.2 R34_AudioInputs_1-8_InputAmplifier4.2 R43_AudioInputs_1-8_InputAmplifier4.2), ADC1 (U14_ADC1.12)
IN4_P: AudioInputs_1-8/InputAmplifier4 (C33_AudioInputs_1-8_InputAmplifier4.1 R26_AudioInputs_1-8_InputAmplifier4.2 R69_AudioInputs_1-8_InputAmplifier4.2), ADC1 (U14_ADC1.11)
IN5_N: AudioInputs_1-8/InputAmplifier5 (C33_AudioInputs_1-8_InputAmplifier5.2 R34_AudioInputs_1-8_InputAmplifier5.2 R43_AudioInputs_1-8_InputAmplifier5.2), ADC1 (U14_ADC1.48)
IN5_P: AudioInputs_1-8/InputAmplifier5 (C33_AudioInputs_1-8_InputAmplifier5.1 R26_AudioInputs_1-8_InputAmplifier5.2 R69_AudioInputs_1-8_InputAmplifier5.2), ADC1 (U14_ADC1.47)
IN6_N: AudioInputs_1-8/InputAmplifier6 (C33_AudioInputs_1-8_InputAmplifier6.2 R34_AudioInputs_1-8_InputAmplifier6.2 R43_AudioInputs_1-8_InputAmplifier6.2), ADC1 (U14_ADC1.2)
IN6_P: AudioInputs_1-8/InputAmplifier6 (C33_AudioInputs_1-8_InputAmplifier6.1 R26_AudioInputs_1-8_InputAmplifier6.2 R69_AudioInputs_1-8_InputAmplifier6.2), ADC1 (U14_ADC1.1)
IN7_N: AudioInputs_1-8/InputAmplifier7 (C33_AudioInputs_1-8_InputAmplifier7.2 R34_AudioInputs_1-8_InputAmplifier7.2 R43_AudioInputs_1-8_InputAmplifier7.2), ADC1 (U14_ADC1.46)
IN7_P: AudioInputs_1-8/InputAmplifier7 (C33_AudioInputs_1-8_InputAmplifier7.1 R26_AudioInputs_1-8_InputAmplifier7.2 R69_AudioInputs_1-8_InputAmplifier7.2), ADC1 (U14_ADC1.45)
IN8_N: AudioInputs_1-8/InputAmplifier8 (C33_AudioInputs_1-8_InputAmplifier8.2 R34_AudioInputs_1-8_InputAmplifier8.2 R43_AudioInputs_1-8_InputAmplifier8.2), ADC1 (U14_ADC1.44)
IN8_P: AudioInputs_1-8/InputAmplifier8 (C33_AudioInputs_1-8_InputAmplifier8.1 R26_AudioInputs_1-8_InputAmplifier8.2 R69_AudioInputs_1-8_InputAmplifier8.2), ADC1 (U14_ADC1.43)
IN9_N: AudioInputs_9-15/InputAmplifier1 (C33_AudioInputs_9-15_InputAmplifier1.2 R34_AudioInputs_9-15_InputAmplifier1.2 R43_AudioInputs_9-15_InputAmplifier1.2), ADC2 (U14_ADC2.16)
IN9_P: AudioInputs_9-15/InputAmplifier1 (C33_AudioInputs_9-15_InputAmplifier1.1 R26_AudioInputs_9-15_InputAmplifier1.2 R69_AudioInputs_9-15_InputAmplifier1.2), ADC2 (U14_ADC2.15)
IN10_N: AudioInputs_9-15/InputAmplifier2 (C33_AudioInputs_9-15_InputAmplifier2.2 R34_AudioInputs_9-15_InputAmplifier2.2 R43_AudioInputs_9-15_InputAmplifier2.2), ADC2 (U14_ADC2.18)
IN10_P: AudioInputs_9-15/InputAmplifier2 (C33_AudioInputs_9-15_InputAmplifier2.1 R26_AudioInputs_9-15_InputAmplifier2.2 R69_AudioInputs_9-15_InputAmplifier2.2), ADC2 (U14_ADC2.17)
IN11_N: AudioInputs_9-15/InputAmplifier3 (C33_AudioInputs_9-15_InputAmplifier3.2 R34_AudioInputs_9-15_InputAmplifier3.2 R43_AudioInputs_9-15_InputAmplifier3.2), ADC2 (U14_ADC2.14)
IN11_P: AudioInputs_9-15/InputAmplifier3 (C33_AudioInputs_9-15_InputAmplifier3.1 R26_AudioInputs_9-15_InputAmplifier3.2 R69_AudioInputs_9-15_InputAmplifier3.2), ADC2 (U14_ADC2.13)
IN12_N: AudioInputs_9-15/InputAmplifier4 (C33_AudioInputs_9-15_InputAmplifier4.2 R34_AudioInputs_9-15_InputAmplifier4.2 R43_AudioInputs_9-15_InputAmplifier4.2), ADC2 (U14_ADC2.12)
IN12_P: AudioInputs_9-15/InputAmplifier4 (C33_AudioInputs_9-15_InputAmplifier4.1 R26_AudioInputs_9-15_InputAmplifier4.2 R69_AudioInputs_9-15_InputAmplifier4.2), ADC2 (U14_ADC2.11)
IN13_N: AudioInputs_9-15/InputAmplifier5 (C33_AudioInputs_9-15_InputAmplifier5.2 R34_AudioInputs_9-15_InputAmplifier5.2 R43_AudioInputs_9-15_InputAmplifier5.2), ADC2 (U14_ADC2.48)
IN13_P: AudioInputs_9-15/InputAmplifier5 (C33_AudioInputs_9-15_InputAmplifier5.1 R26_AudioInputs_9-15_InputAmplifier5.2 R69_AudioInputs_9-15_InputAmplifier5.2), ADC2 (U14_ADC2.47)
IN14_N: AudioInputs_9-15/InputAmplifier6 (C33_AudioInputs_9-15_InputAmplifier6.2 R34_AudioInputs_9-15_InputAmplifier6.2 R43_AudioInputs_9-15_InputAmplifier6.2), ADC2 (U14_ADC2.2)
IN14_P: AudioInputs_9-15/InputAmplifier6 (C33_AudioInputs_9-15_InputAmplifier6.1 R26_AudioInputs_9-15_InputAmplifier6.2 R69_AudioInputs_9-15_InputAmplifier6.2), ADC2 (U14_ADC2.1)
IN15_N: AudioInputs_9-15/InputAmplifier7 (C33_AudioInputs_9-15_InputAmplifier7.2 R34_AudioInputs_9-15_InputAmplifier7.2 R43_AudioInputs_9-15_InputAmplifier7.2), ADC2 (U14_ADC2.46)
IN15_P: AudioInputs_9-15/InputAmplifier7 (C33_AudioInputs_9-15_InputAmplifier7.1 R26_AudioInputs_9-15_InputAmplifier7.2 R69_AudioInputs_9-15_InputAmplifier7.2), ADC2 (U14_ADC2.45)
IN16_N: AudioInputs_9-15/InputAmplifier8 (C33_AudioInputs_9-15_InputAmplifier8.2 R34_AudioInputs_9-15_InputAmplifier8.2 R43_AudioInputs_9-15_InputAmplifier8.2), ADC2 (U14_ADC2.44)
IN16_P: AudioInputs_9-15/InputAmplifier8 (C33_AudioInputs_9-15_InputAmplifier8.1 R26_AudioInputs_9-15_InputAmplifier8.2 R69_AudioInputs_9-15_InputAmplifier8.2), ADC2 (U14_ADC2.43)
LRCLK: TopLevel (TP6.1 TP6.2), XMOS_chip (R801.1), ADC2 (U14_ADC2.24), ADC1 (U14_ADC1.24), DAC (U17.7)
MCLK_AUDIO: TopLevel (R65.1 R66.2 TP4.1 TP4.2), ADC2 (U14_ADC2.23), ADC1 (U14_ADC1.23), DAC (U17.6)
MCLK_XCORE: TopLevel (R65.2), XMOS_chip (U4.13 U4.63), Clock (R2.2)
NetC36_+: DAC (U17.39), OutputConnectors (C36.+ D6126.3)
NetC37_+: DAC (U17.35), OutputConnectors (C37.+ D6124.3)
NetC40_+: DAC (U17.38), OutputConnectors (C40.+ D6125.3)
NetC41_+: DAC (U17.34), OutputConnectors (C41.+ D6123.3)
NetD4_2: XMOS_chip (D4.2 D4.3), XMOS_power (SW2.1 SW3.1 U10.1)
NetP19_5: XMOS_chip (U4.122), Other (P19.5)
NetR7_ADC1_2: TopLevel (TP7.1 TP7.2), XMOS_chip (U4.96), ADC2 (R7_ADC2.2 U14_ADC2.36), ADC1 (R7_ADC1.2 U14_ADC1.36)
NetR8_1: XMOS_chip (U4.71), Other (R8.1)
NetR10_1: XMOS_chip (U4.70), Other (R10.1)
NetR17_2: XMOS_chip (U4.125), Clock (R17.2)
NetR45_1: XMOS_chip (U4.69), Other (R45.1)
NetR66_1: TopLevel (R66.1), XMOS_chip (U4.93)
NetTP3_1: TopLevel (TP3.1 TP3.2), XMOS_chip (U4.95), ADC2 (U14_ADC2.41), ADC1 (U14_ADC1.41)
NetU2_5: XMOS_chip (U4.30), Clock (U2.5)
NetU4_94: XMOS_chip (U4.94), DAC (U17.19)
SCLK: TopLevel (TP5.1 TP5.2), XMOS_chip (R802.1), ADC2 (U14_ADC2.25), ADC1 (U14_ADC1.25), DAC (U17.9)